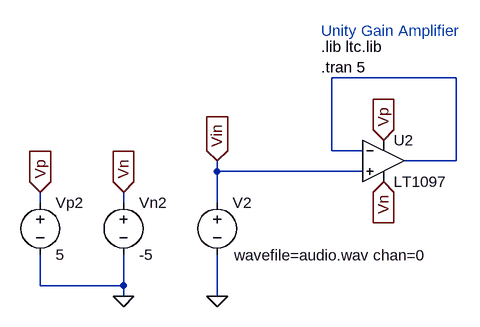
[diagram p0: schematic unity_gain_amp.asc]
unity_gain_amp.asc, the LTspice schematic file:
Version 4
SHEET 1 1364 680
WIRE 464 -96 272 -96
WIRE 272 16 272 -96
WIRE 320 16 272 16
WIRE 464 32 464 -96
WIRE 464 32 384 32
WIRE 96 48 96 32
WIRE 320 48 96 48
WIRE -176 96 -176 80
WIRE -48 96 -48 80
WIRE 96 96 96 48
WIRE -176 224 -176 176
WIRE -48 224 -48 176
WIRE -48 224 -176 224
WIRE -48 240 -48 224
WIRE 96 240 96 176
FLAG 96 240 0
FLAG -48 240 0
FLAG -176 80 Vp
IOPIN -176 80 In
FLAG -48 80 Vn
IOPIN -48 80 In
FLAG 352 64 Vn
IOPIN 352 64 In
FLAG 352 0 Vp
IOPIN 352 0 In
FLAG 96 32 Vin
IOPIN 96 32 In
SYMBOL voltage 96 80 R0
WINDOW 123 0 0 Left 0
WINDOW 39 0 0 Left 0
WINDOW 3 26 97 Left 2
SYMATTR Value wavefile=audio.wav chan=0
SYMATTR InstName V2
SYMBOL voltage -176 80 R0
WINDOW 123 0 0 Left 0
WINDOW 39 0 0 Left 0
SYMATTR InstName Vp2
SYMATTR Value 5
SYMBOL voltage -48 80 R0
WINDOW 123 0 0 Left 0
WINDOW 39 0 0 Left 0
SYMATTR InstName Vn2
SYMATTR Value -5
SYMBOL OpAmps\\opamp2 352 -32 R0
SYMATTR InstName U2
SYMATTR Value LT1097
TEXT 256 -112 Left 2 !.tran 5
TEXT 256 -144 Left 2 !.lib ltc.lib
TEXT 256 -168 Left 2 ;Unity Gain Amplifier

The netlist it stands for:
* unity_gain_amp.asc
V2 Vin 0 wavefile=audio.wav chan=0
Vp2 Vp 0 5
Vn2 Vn 0 -5
XU2 Vin N001 Vp Vn N001 LT1097  ; pins In+ In- V+ V- OUT
.tran 5
.lib ltc.lib
* Unity Gain Amplifier
.backanno
.end